# Altium schematic sheet 01.Under_voltage_detection.SchDoc
size A4; Organization: Electronic and Telecommunication Department - University of Moratuwa; Address1: Bandaranayake Mawatha; Address2: Moratuwa; Address3: Sri Lanka; Address4: 10400; DocumentNumber: 01; SheetNumber: 1; SheetTotal: 4; Page: Under voltage detection; SPICEModelCache: <root> / <DocumentId>AJVEDORQ</DocumentId> / </root>
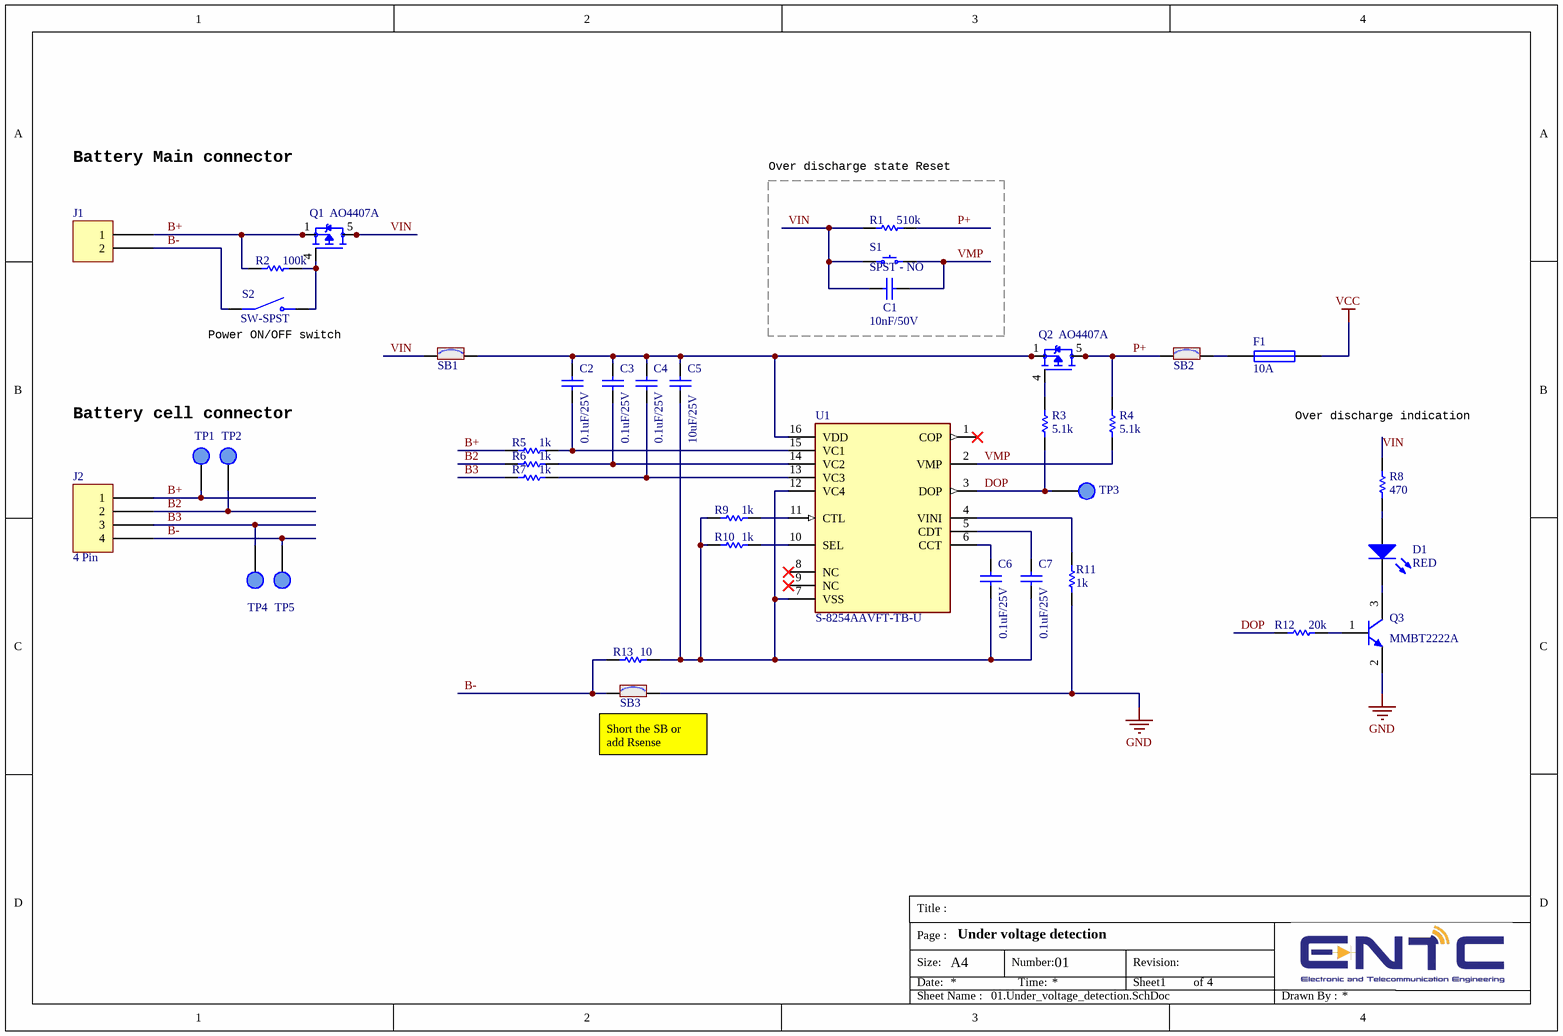
[diagram p0: 01.Under_voltage_detection.SchDoc]

## Parts
C1  10nF/50V  [cap0805]
C2  0.1uF/25V  [cap0805]
C3  0.1uF/25V  [cap0805]
C4  0.1uF/25V  [cap0805]
C5  10uF/25V  [cap0805]
C6  0.1uF/25V  [cap0805]
C7  0.1uF/25V  [cap0805]
D1  RED  [LED0805]
F1  10A  [FUSE_4245]
J1  (no value)  [JST XH B2B-XH-A]
J2  4 Pin  [JST XH B4B-XH-A]
Q1  AO4407A  [SOIC127P600X175-8N]
Q2  AO4407A  [SOIC127P600X175-8N]
Q3  MMBT2222A  [SOT23]
R1  510k  [RES0805]
R2  100k  [RES0805]
R3  5.1k  [RES0805]
R4  5.1k  [RES0805]
R5  1k  [RES0805]
R6  1k  [RES0805]
R7  1k  [RES0805]
R8  470  [RES0805]
R9  1k  [RES0805]
R10  1k  [RES0805]
R11  1k  [RES0805]
R12  20k  [RES0805]
R13  10  [RES0805]
S1  SPST - NO  [4312560387x6]
S2  SW-SPST  [SW_TL2230EEF100]
SB1  SB_ON  [SOLDER-BRIDGE_R0805-0R]  (value not drawn)
SB2  SB_ON  [SOLDER-BRIDGE_R0805-0R]  (value not drawn)
SB3  SB_ON  [SOLDER-BRIDGE_R0805-0R]  (value not drawn)
TP1  (no value)  [tp]  (no BOM)
TP2  (no value)  [tp]  (no BOM)
TP3  (no value)  [tp]  (no BOM)
TP4  (no value)  [tp]  (no BOM)
TP5  (no value)  [tp]  (no BOM)
U1  S-8254AAVFT-TB-U  [SOP65P640X110-16N]

## Blocks framed on the sheet
Over discharge state Reset: C1 R1 S1

## Nets
GND: Q3.2(E) R11.1 SB3.2
VCC: F1.2
B2: J2.2 R6.1 TP2.1(TP)
B3: J2.3 R7.1 TP4.1(TP)
B+: J1.1 J2.1 Q1.1(S) Q1.2(S) Q1.3(S) R2.1 R5.1 TP1.1(TP)
B-: J1.2 J2.4 R13.1 S2.2(COM) SB3.1 TP5.1(TP)
DOP: R3.1 R12.2 TP3.1(TP) U1.3(DOP)
P+: Q2.5(D) Q2.6(D) Q2.7(D) Q2.8(D) R1.1 R4.2 SB2.1
VIN: C1.2 Q1.5(D) Q1.6(D) Q1.7(D) Q1.8(D) R1.2 R8.2 S1.1 SB1.1
VMP: C1.1 R4.1 S1.2 U1.2(VMP)
NetC2_1: C2.1 R5.2 U1.15(VC1)
NetC2_2: C2.2 C3.2 C4.2 C5.2 Q2.1(S) Q2.2(S) Q2.3(S) SB1.2 U1.16(VDD)
NetC3_1: C3.1 R6.2 U1.14(VC2)
NetC4_1: C4.1 R7.2 U1.13(VC3)
NetC5_1: C5.1 C6.1 C7.1 R9.1 R10.1 R13.2 U1.7(VSS) U1.12(VC4)
NetC6_2: C6.2 U1.6(CCT)
NetC7_2: C7.2 U1.5(CDT)
NetD1_1: D1.1(A) R8.1
NetD1_2: D1.2(K) Q3.3(C)
NetF1_1: F1.1 SB2.2
NetQ1_4: Q1.4(G) R2.2 S2.3(NO)
NetQ2_4: Q2.4(G) R3.2
NetQ3_1: Q3.1(B) R12.1
NetR9_2: R9.2 U1.11(CTL)
NetR10_2: R10.2 U1.10(SEL)
NetR11_2: R11.2 U1.4(VINI)

Not connected (* = marked no-connect by the designer): U1 1(COP)* 8(NC)* 9(NC)*

## Notes on the sheet
- Battery Main connector
- (near S2) Power ON/OFF switch
- Battery cell connector
- Over discharge indication
- (near SB3) Short the SB or add Rsense
- Title :
- Size:
- Date:
- Page :
- A4
- Number:
- Time:
- Revision:
- Sheet
- of
- Sheet Name :
- Drawn By :

## Library data of the parts
C1 = Cap: Multilayer Ceramic Capacitors MLCC - SMD/SMT 50V 0.01uF X7R 0805 10%; MF: YAGEO; MP: CC0805KRX7R9BB103; MOUSER: 603-CC805KRX7R9BB103
C2-C4 C6 C7 = Cap: Multilayer Ceramic Capacitors MLCC - SMD/SMT KAF21BR71E104KT NEW GLOBAL PN 25V .1uF X A 581-KAF21BR71E104KT; MF: KYOCERA AVX; MP: 08053C104K4Z2A; MOUSER: 581-08053C104K4Z2A
C5 = Cap: Multilayer Ceramic Capacitors MLCC - SMD/SMT KGM21AR51E106KL NEW GLOBAL PN 25V 10uF X A 581-KGM21AR51E106KL; MF: KYOCERA AVX; MP: 08053D106KAT4A; MOUSER: 581-08053D106KAT4A
D1 = LED: Standard LEDs - SMD Super Red, 630nm 9mcd, 2mA; MF: ams OSRAM; MP: LS M67K-H2K1-1-Z; MOUSER: 720-LSM67K-H2K1-1-Z
F1 = Fuse: 10A Glass fuse
J1 = NC6-P108-02: CONN BARRIER STRIP 2CIRC 0.375"
J2 = NC6-P108-04: JST Automotive Connectors XH HEADER (TOP); MP: B4B-XH-AM(LF)(SN); MF: JST Commercial; MOUSER: 306-B4BXHAMLFSNP
Q1 Q2 = AO4407A: MOSFETs P-Channel 2.5W; MP: DMP3020LSS-13; MF: Diodes Incorporated; MOUSER: 621-DMP3020LSS-13
Q3 = NPN: NPN Bipolar Transistor; MF: Diotec Semiconductor; MP: MMBT2222A; MOUSER: 637-MMBT2222A
R1 = Res: Thick Film Resistors - SMD 510K 5%; MP: CR0805-JW-514ELF; MF: Bourns; MOUSER: 652-CR0805JW-514ELF
R2 = Res: Thick Film Resistors - SMD 100K 5%; MP: CR0805-JW-104ELF; MF: Bourns; MOUSER: 652-CR0805JW-104ELF
R3 R4 = Res: Thick Film Resistors - SMD 5.1Kohms 1% 100ppm; MP: RCA08055K10FKEA; MF: Vishay / Draloric; MOUSER: 71-RCA08055K10FKEA
R5 R6 R11 = Res: Thick Film Resistors - SMD 1 kOhms 125 mW 0805 1%; MP: RC0805FR-071KL; MF: YAGEO; MOUSER: 603-RC0805FR-071KL
R7 = Res: Resistor 0805Thick Film Resistors - SMD 1 kOhms 125 mW 0805 1%; MP: RC0805FR-071KL; MF: YAGEO; MOUSER: 603-RC0805FR-071KL
R8 = Res: Thick Film Resistors - SMD 470ohm 5%; MP: CR0805-JW-471ELF; MF: Bourns; MOUSER: 652-CR0805JW-471EL
R9 R10 = Res: Resistor 0805; MP: RC0805FR-071KL; MF: YAGEO; MOUSER: 603-RC0805FR-071KL
R12 = Res: Thick Film Resistors - SMD 20K 1%; MP: CR0805-FX-2002ELF; MF: Bourns; MOUSER: 652-CR0805FX-2002ELF
R13 = Res: Thin Film Resistors - SMD 10 ohm 1% 50 ppm Thin Film; MP: RT0805FRE1310RL; MF: YAGEO; MOUSER: 603-RT0805FRE1310RL
S1 = SPST-NO 4 PIN: Switch Push button
SB1-SB3 = SB_ON: Solder Bridge ON; MP: CR0805AJ/-000EAS; MF: Bourns; MOUSER: 652-CR0805AJ/-000EAS
TP1-TP5 = TP: Test Point
U1 = S-8254AAEFT-TB-G: Battery Management LITHIUM-ION BATTERY PROTECTION 3/4 CELL; MF: ABLIC; MP: S-8254AAVFT-TB-U; MOUSER: 628-S-8254AAVFT-TB-U